# Altium schematic sheet TRACKER.SchDoc
size 699 x 500 mm; SheetNumber: 1; SheetTotal: 1
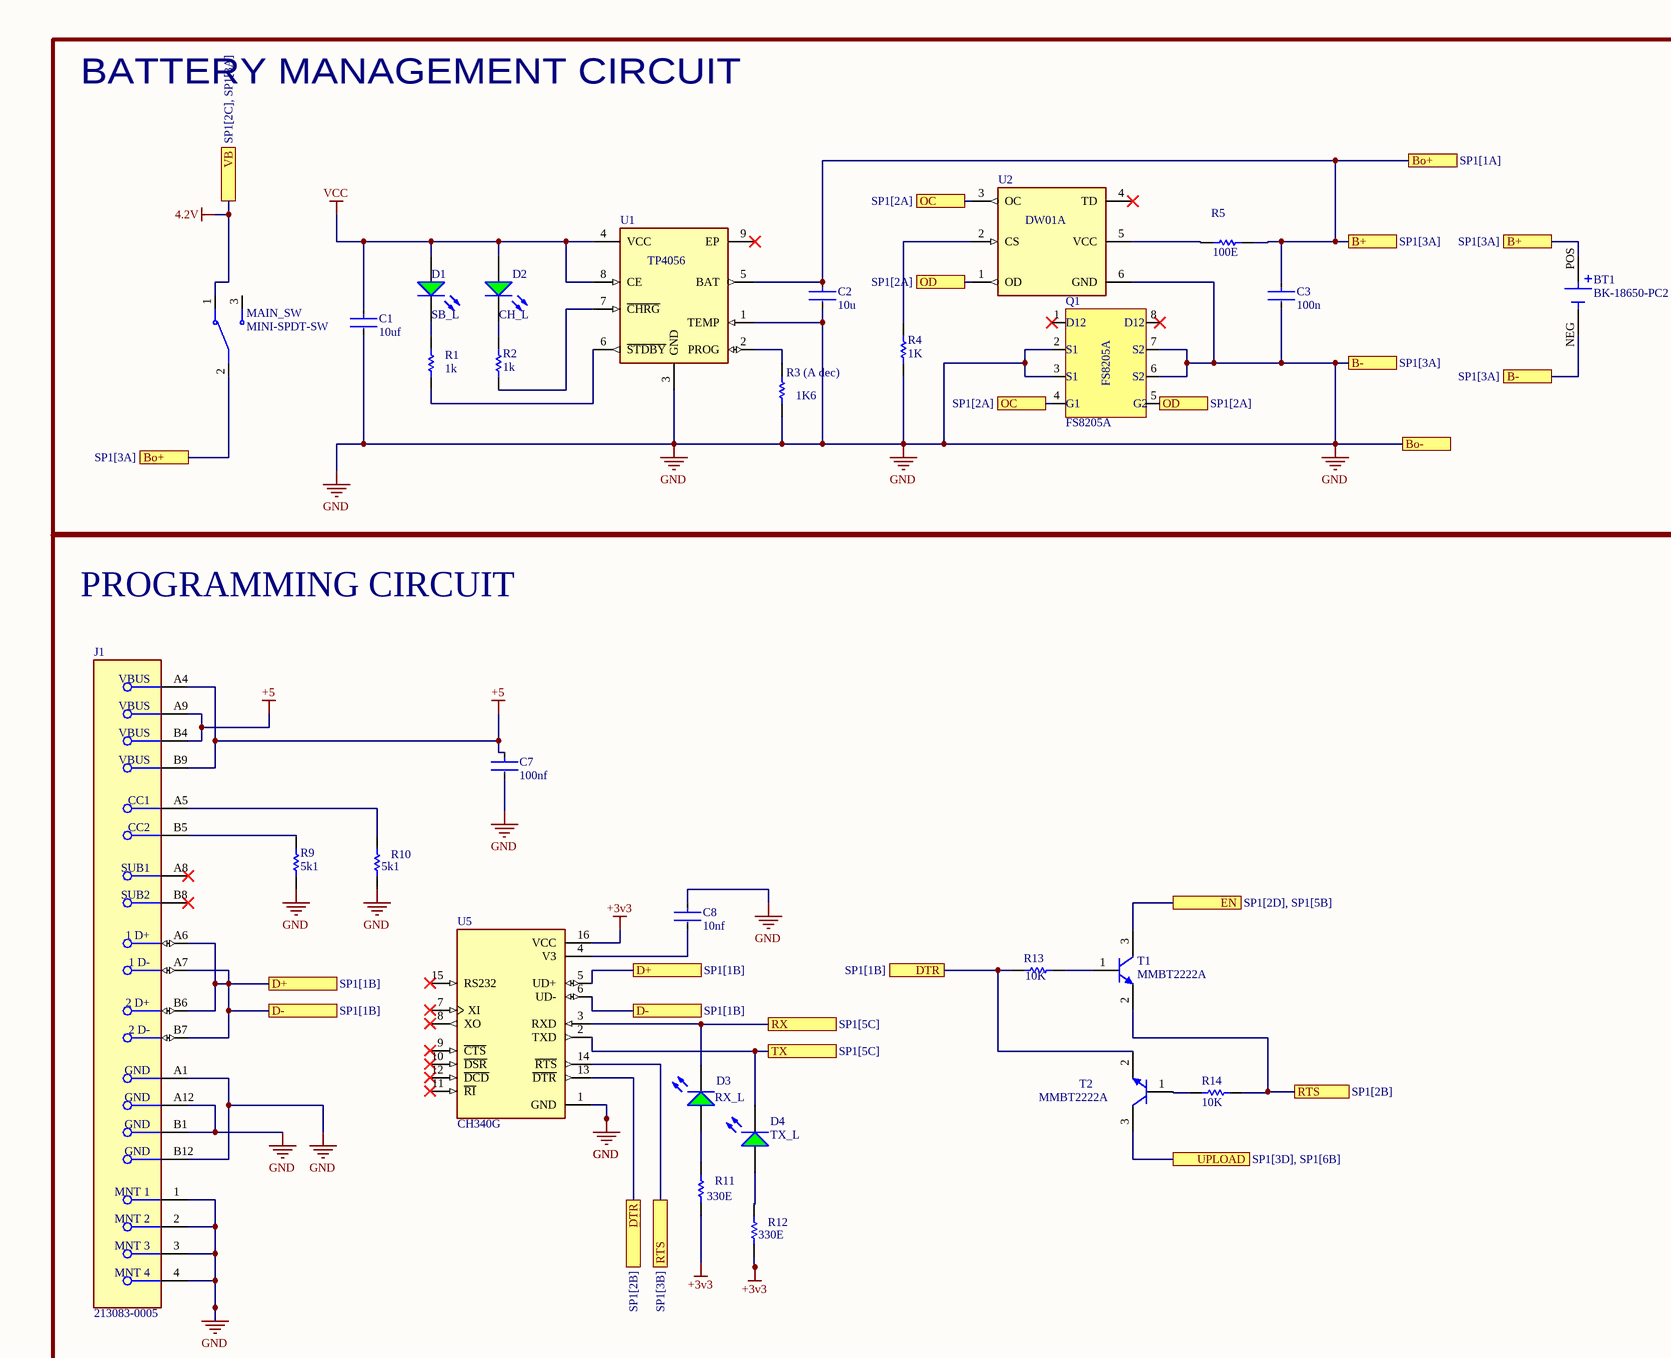
[diagram p0: TRACKER.SchDoc, top left]
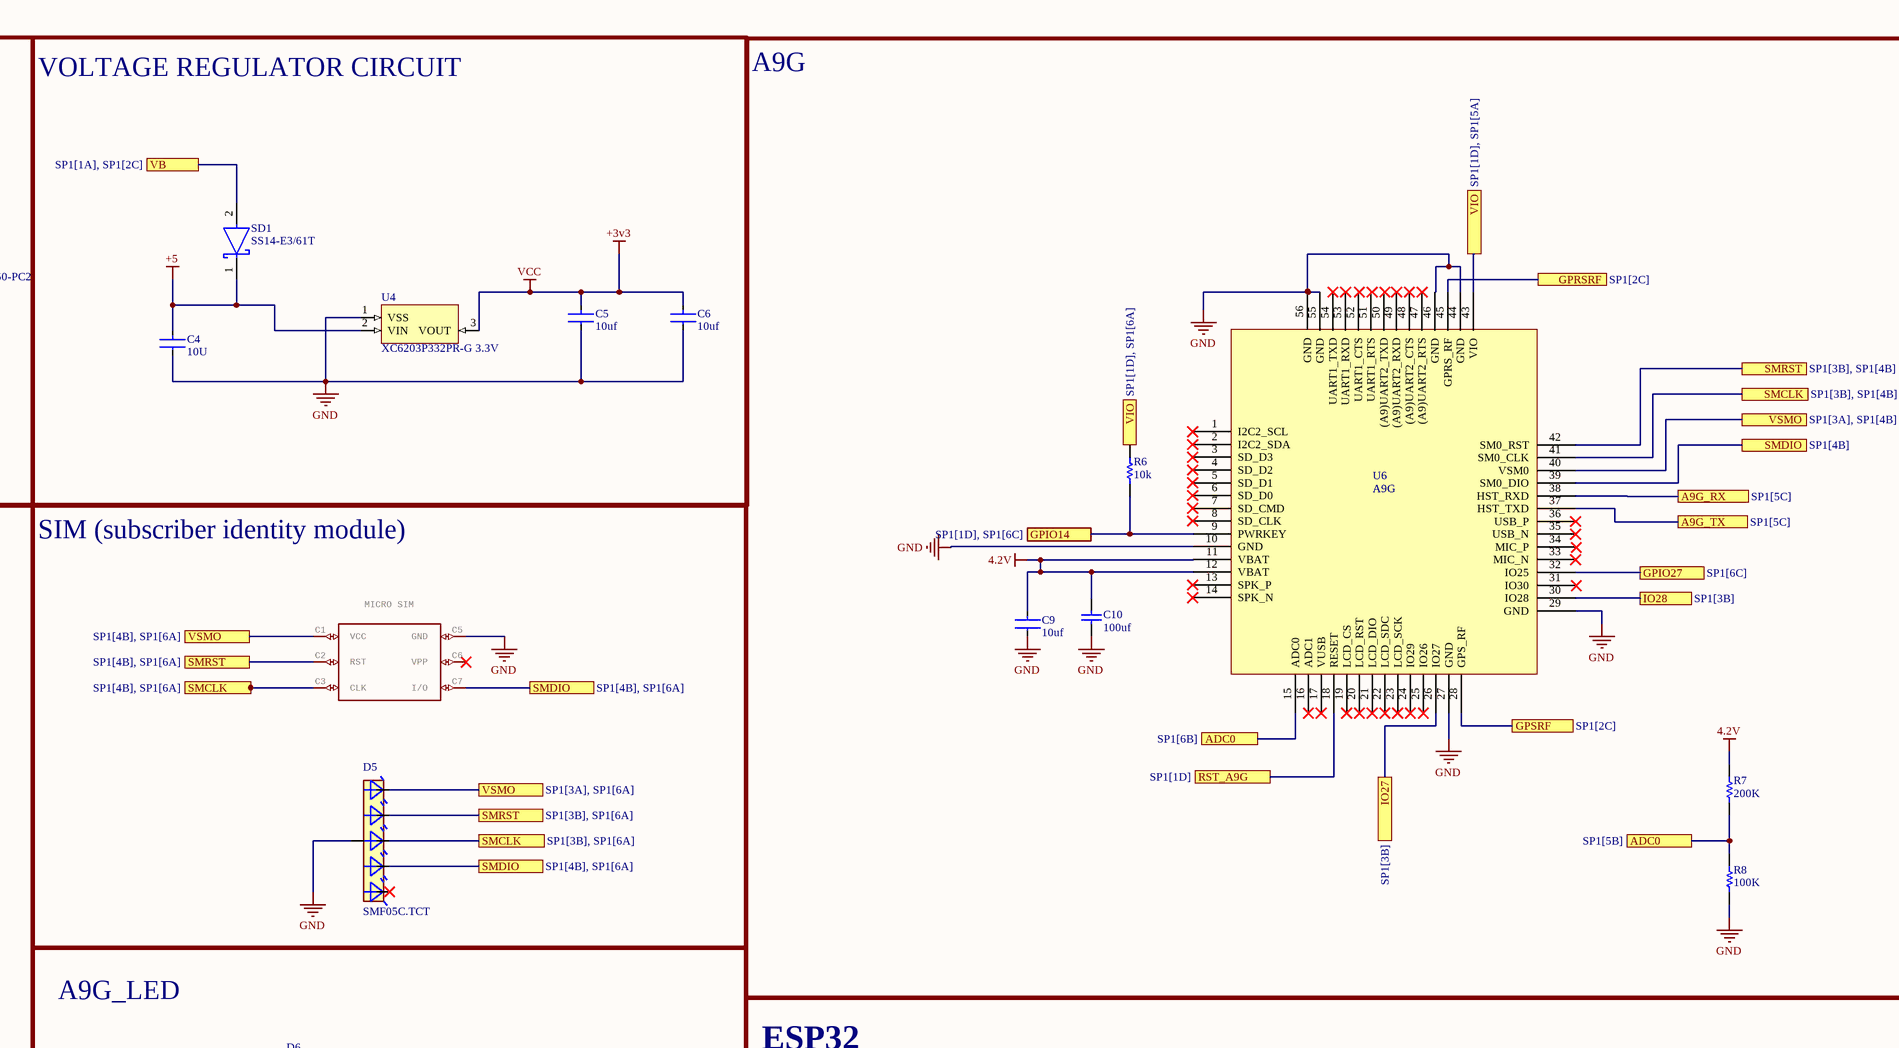
[diagram p1: TRACKER.SchDoc, top right]
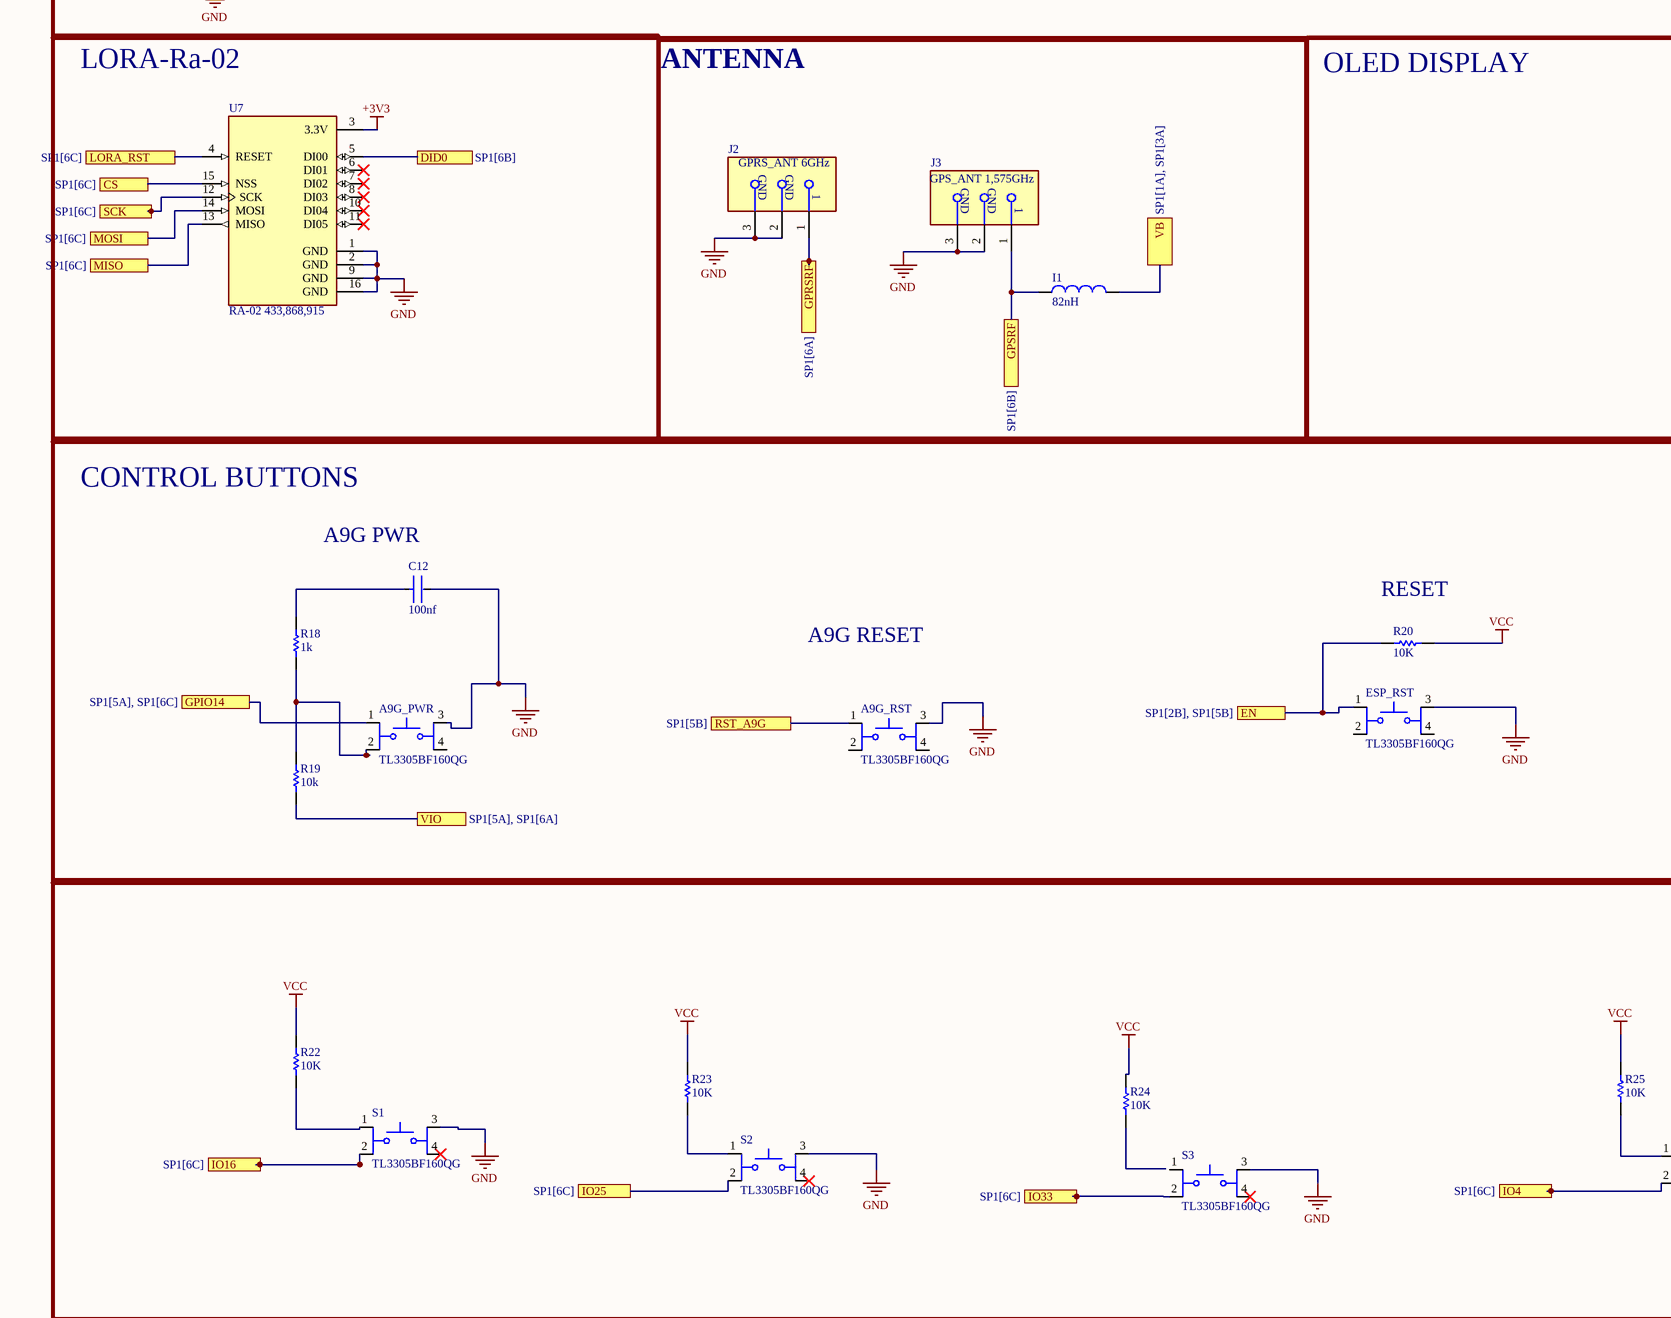
[diagram p2: TRACKER.SchDoc, bottom left]
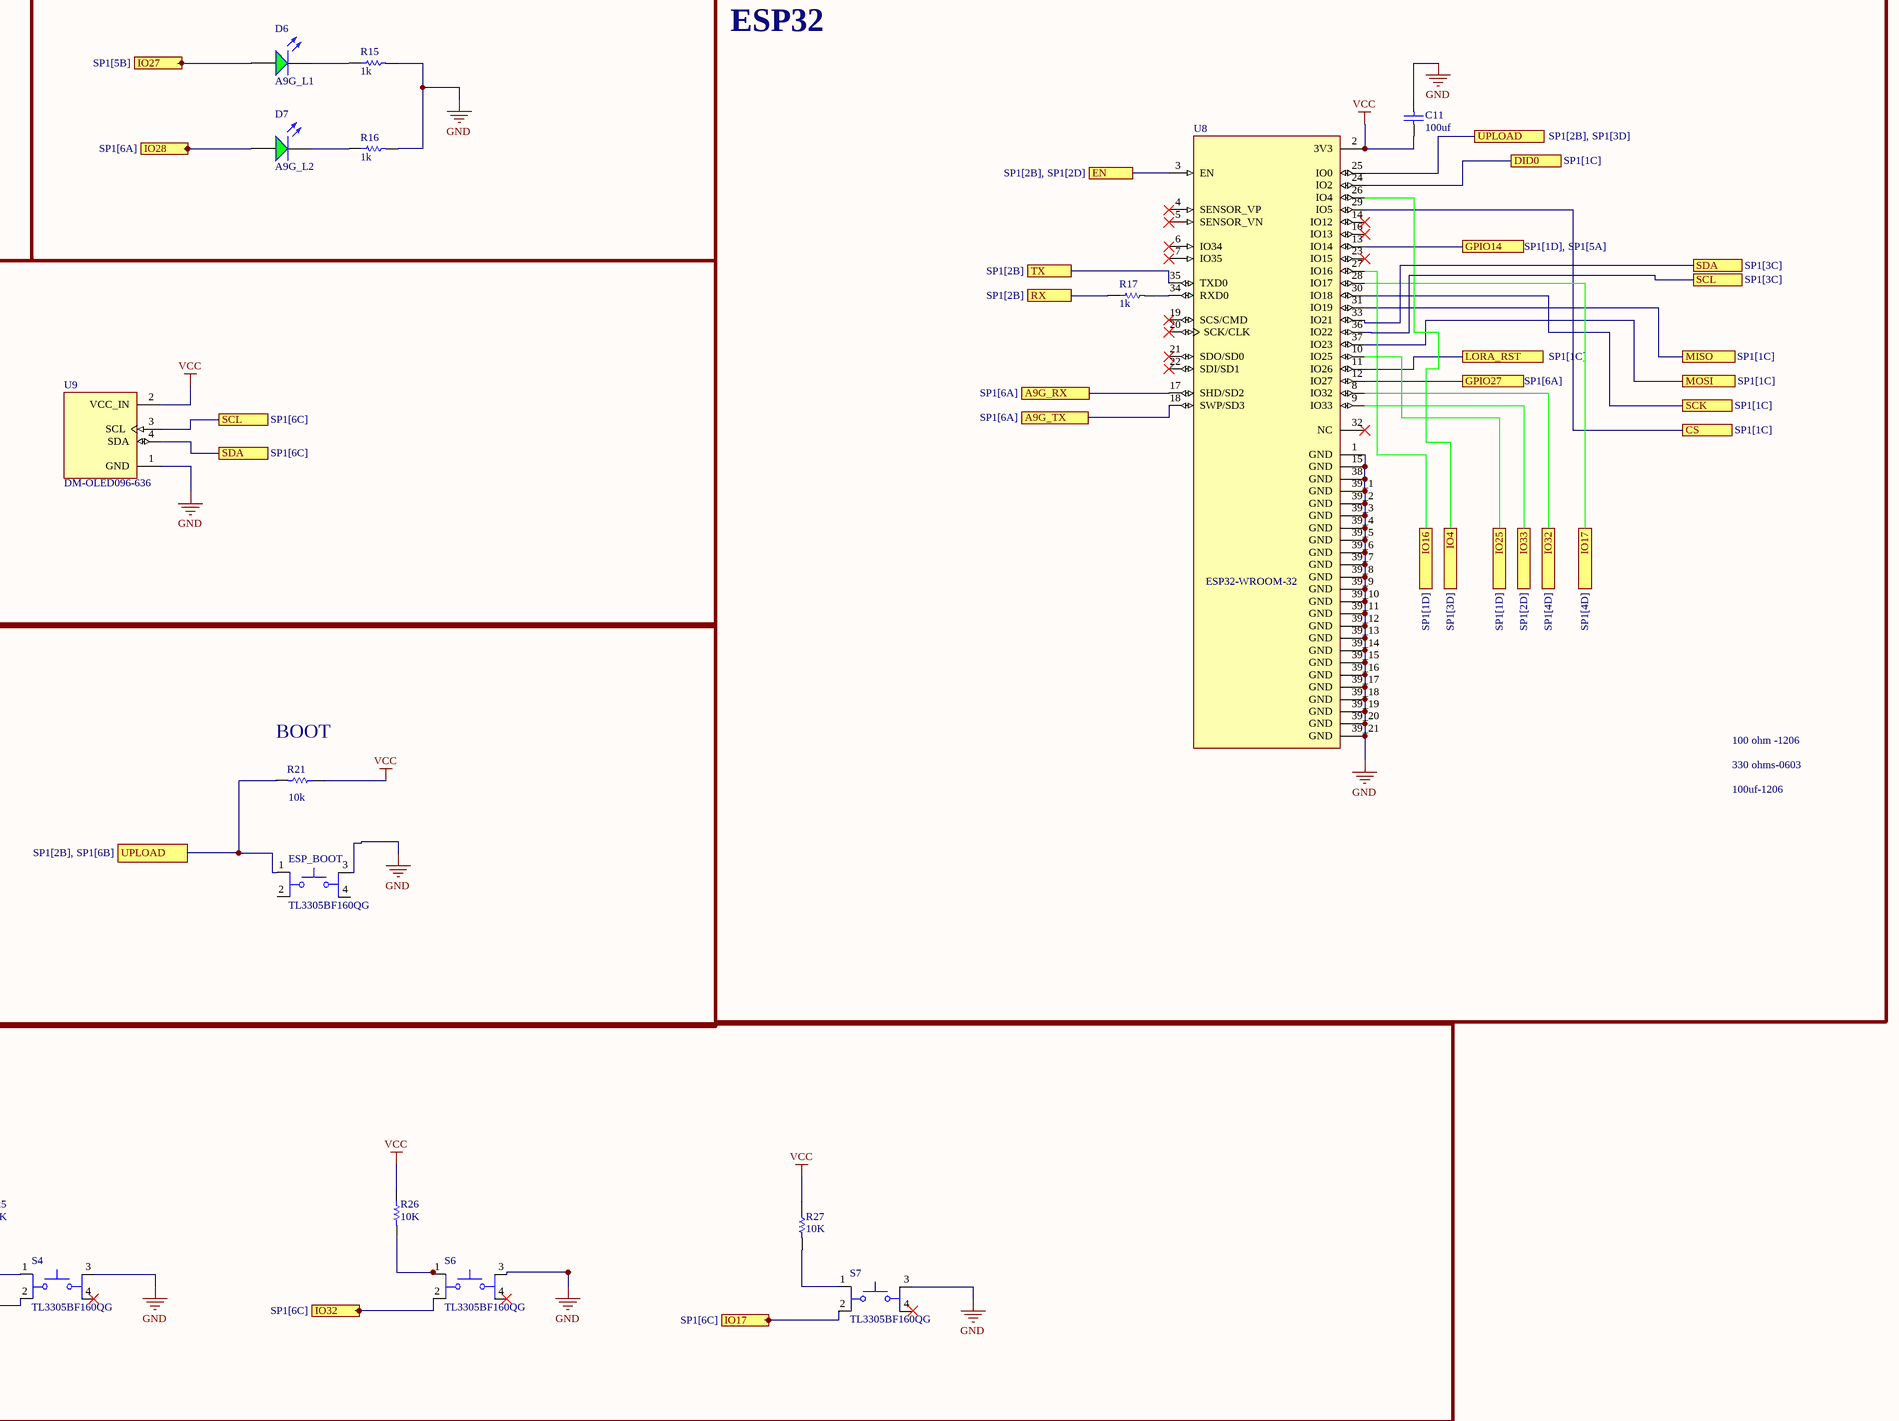
[diagram p3: TRACKER.SchDoc, bottom right]

## Parts
A9G_PWR  TL3305BF160QG  [SW_TL3305BF160QG]
A9G_RST  TL3305BF160QG  [SW_TL3305BF160QG]
BT1  BK-18650-PC2  [BAT_BK-18650-PC2]
C1  10uf  [FP-0805-L_2_01_0_2-W_1_25-MFG]
C2  10u  [FP-0805-L_2_01_0_2-W_1_25-MFG]
C3  100n  [FP-0805-L_2_01_0_2-W_1_25-MFG]
C4  10U  [FP-0805-L_2_01_0_2-W_1_25-MFG]
C5  10uf  [FP-0805-L_2_01_0_2-W_1_25-MFG]
C6  10uf  [FP-0805-L_2_01_0_2-W_1_25-MFG]
C7  100nf  [FP-0805-L_2_01_0_2-W_1_25-MFG]
C8  10nf  [FP-0805-L_2_01_0_2-W_1_25-MFG]
C9  10uf  [FP-0805-L_2_01_0_2-W_1_25-MFG]
C10  100uf  [AVX-1206-2_L]
C11  100uf  [AVX-1206-2_L]
C12  100nf  [FP-0805-L_2_01_0_2-W_1_25-MFG]
D1  SB_L  [WL-SMCW_0805_150080xx75000]
D2  CH_L  [WL-SMCW_0805_150080xx75000]
D3  RX_L  [WL-SMCW_0805_150080xx75000]
D4  TX_L  [WL-SMCW_0805_150080xx75000]
D5  SMF05C.TCT  [SC70-6]
D6  A9G_L1  [WL-SMCW_0805_150080xx75000]
D7  A9G_L2  [WL-SMCW_0805_150080xx75000]
ESP_BOOT  TL3305BF160QG  [SW_TL3305BF160QG]
ESP_RST  TL3305BF160QG  [SW_TL3305BF160QG]
I1  82nH  [INDC1608X90X30LL10T20]
J1  213083-0005  [FP-2130830005-MFG]
J2  GPRS_ANT 6GHz  [FP-U_FL-R-SMT-1_80-MFG]
J3  GPS_ANT 1,575GHz  [FP-U_FL-R-SMT-1_80-MFG]
MAIN_SW  MINI-SPDT-SW  [SW_MINI-SPDT-SW]
MICRO_SIM  6 Pin Micro SIM Holder - This is Micro SIM Card Holder â€“ SMD Type with standard interface of 6 pins. The interface for sim card is a spring loaded push type. In this interface, pushing the sim card removes or inserts it.    Buy Link  [MICRO-SIM_SIM_MICRO]  (value not drawn)
Q1  FS8205A  [SOP65P640X120-8N]
R1  1k  [RESC2013X50X30LL20T20]
R2  1k  [RESC2013X50X30LL20T20]
R3_(A_dec)  1K6  [RESC2013X50X30LL20T20]
R4  1K  [RESC2013X50X30LL20T20]
R5  100E  [RESC2013X50X30LL20T20]
R6  10k  [RESC2013X50X30LL20T20]
R7  200K  [RESC2013X50X30LL20T20]
R8  100K  [RESC2013X50X30LL20T20]
R9  5k1  [RESC2013X50X30LL20T20]
R10  5k1  [RESC2013X50X30LL20T20]
R11  330E  [RESC2013X50X30LL20T20]
R12  330E  [RESC2013X50X30LL20T20]
R13  10K  [RESC2013X50X30LL20T20]
R14  10K  [RESC2013X50X30LL20T20]
R15  1k  [RESC2013X50X30LL20T20]
R16  1k  [RESC2013X50X30LL20T20]
R17  1k  [RESC2013X50X30LL20T20]
R18  1k  [RESC2013X50X30LL20T20]
R19  10k  [RESC2013X50X30LL20T20]
R20  10K  [RESC2013X50X30LL20T20]
R21  10k  [RESC2013X50X30LL20T20]
R22  10K  [RESC2013X50X30LL20T20]
R23  10K  [RESC2013X50X30LL20T20]
R24  10K  [RESC2013X50X30LL20T20]
R25  10K  [RESC2013X50X30LL20T20]
R26  10K  [RESC2013X50X30LL20T20]
R27  10K  [RESC2013X50X30LL20T20]
S1  TL3305BF160QG  [SW_TL3305BF160QG]
S2  TL3305BF160QG  [SW_TL3305BF160QG]
S3  TL3305BF160QG  [SW_TL3305BF160QG]
S4  TL3305BF160QG  [SW_TL3305BF160QG]
S6  TL3305BF160QG  [SW_TL3305BF160QG]
S7  TL3305BF160QG  [SW_TL3305BF160QG]
SD1  SS14-E3/61T  [FP-95400-MFG]
T1  MMBT2222A  [INF-SOT23_M]
T2  MMBT2222A  [INF-SOT23_M]
U1  TP4056  [SOP127P600X175-9N]
U2  DW01A  [SOT95P280X145-6N]
U4  XC6203P332PR-G 3.3V  [SOT89-150P410X150-3N]
U5  CH340G  [SOIC127P600X180-16N]
U6  A9G  [A9G]
U7  RA-02 433,868,915  [RA-02]
U8  ESP32-WROOM-32  [MODULE_ESP32-WROOM-32]
U9  DM-OLED096-636  [MODULE_DM-OLED096-636]

## Blocks framed on the sheet
BATTERY MANAGEMENT CIRCUIT: BT1 C1-C3 D1 D2 MAIN_SW Q1 R1 R2 R3_(A_dec) R4 R5 U1 U2
VOLTAGE REGULATOR CIRCUIT: C4-C6 SD1 U4
A9G: C9 C10 R6-R8 U6
PROGRAMMING CIRCUIT: C7 C8 D3 D4 J1 R9-R14 T1 T2 U5
SIM (subscriber identity module): D5 MICRO_SIM
A9G_LED: D6 D7 R15 R16
ESP32: C11 R17 U8
LORA-Ra-02: U7
ANTENNA: I1 J2 J3
OLED DISPLAY: U9
CONTROL BUTTONS: A9G_PWR A9G_RST C12 ESP_BOOT ESP_RST R18-R21

## Ports
A9G_RX (see SP1[5C]), A9G_RX (see SP1[6A]), A9G_TX (see SP1[5C]), A9G_TX (see SP1[6A]), ADC0 (see SP1[5B]), ADC0 (see SP1[6B]), B+ (see SP1[3A]), B- (see SP1[3A]), Bo+ (see SP1[1A]), Bo+ (see SP1[3A]), Bo-, CS (see SP1[1C]), CS (see SP1[6C]), D+ (see SP1[1B]), D- (see SP1[1B]), DID0 (see SP1[1C]), DID0 (see SP1[6B]), DTR (see SP1[1B]), DTR (see SP1[2B]), EN (see SP1[2B], SP1[2D]), EN (see SP1[2B], SP1[5B]), EN (see SP1[2D], SP1[5B]), GPIO14 (see SP1[1D], SP1[5A]), GPIO14 (see SP1[1D], SP1[6C]), GPIO14 (see SP1[5A], SP1[6C]), GPIO27 (see SP1[6A]), GPIO27 (see SP1[6C]), GPRSRF (see SP1[2C]), GPRSRF (see SP1[6A]), GPSRF (see SP1[2C]), GPSRF (see SP1[6B]), IO4 (see SP1[3D]), IO4 (see SP1[6C]), IO16 (see SP1[1D]), IO16 (see SP1[6C]), IO17 (see SP1[4D]), IO17 (see SP1[6C]), IO25 (see SP1[1D]), IO25 (see SP1[6C]), IO27 (see SP1[3B]), IO27 (see SP1[5B]), IO28 (see SP1[3B]), IO28 (see SP1[6A]), IO32 (see SP1[4D]), IO32 (see SP1[6C]), IO33 (see SP1[2D]), IO33 (see SP1[6C]), LORA_RST (see SP1[1C]), LORA_RST (see SP1[6C]), MISO (see SP1[1C]), MISO (see SP1[6C]), MOSI (see SP1[1C]), MOSI (see SP1[6C]), OC (see SP1[2A]), OD (see SP1[2A]), RST_A9G (see SP1[1D]), RST_A9G (see SP1[5B]), RTS (see SP1[2B]), RTS (see SP1[3B]), RX (see SP1[2B]), RX (see SP1[5C]), SCK (see SP1[1C]), SCK (see SP1[6C]), SCL (see SP1[3C]), SCL (see SP1[6C]), SDA (see SP1[3C]), SDA (see SP1[6C]), SMCLK (see SP1[3B], SP1[4B]), SMCLK (see SP1[3B], SP1[6A]), SMCLK (see SP1[4B], SP1[6A]), SMDIO (see SP1[4B]), SMDIO (see SP1[4B], SP1[6A]), SMRST (see SP1[3B], SP1[4B]), SMRST (see SP1[3B], SP1[6A]), SMRST (see SP1[4B], SP1[6A]), TX (see SP1[2B]), TX (see SP1[5C]), UPLOAD (see SP1[2B], SP1[3D]), UPLOAD (see SP1[2B], SP1[6B]), UPLOAD (see SP1[3D], SP1[6B]), VB (see SP1[1A], SP1[2C]), VB (see SP1[1A], SP1[3A]), VB (see SP1[2C], SP1[3A]), VIO (see SP1[1D], SP1[5A]), VIO (see SP1[1D], SP1[6A]), VIO (see SP1[5A], SP1[6A]), VSMO (see SP1[3A], SP1[4B]), VSMO (see SP1[3A], SP1[6A]), VSMO (see SP1[4B], SP1[6A])

## Nets
4.2V: C9.1 C10.1 I1.2 MAIN_SW.1 R7.2 SD1.2(A) U6.12(VBAT) ; port VB
+3v3: C1.1 C5.1 C6.1 C11.1 D1.2(A) D2.2(A) R11.1 R12.1 R20.1 R21.1 R22.1 R23.1 R24.1 R25.1 R26.1 R27.1 U1.4(VCC) U1.8(CE) U4.3(VOUT) U5.16(VCC) U7.3(3.3V) U8.2(3V3) U9.2(VCC_IN)  [also labelled VCC]
+5: C4.1 C7.1 J1.A4(VBUS) J1.A9(VBUS) J1.B4(VBUS) J1.B9(VBUS) SD1.1(C) U4.2(VIN)
GND: A9G_PWR.3 A9G_RST.3 BT1.NEG C1.2 C2.2 C3.2 C4.2 C5.2 C6.2 C7.2 C8.1 C9.2 C10.2 C11.2 C12.2 D5.2(A) ESP_BOOT.3 ESP_RST.3 J1.1(MNT_1) J1.2(MNT_2) J1.3(MNT_3) J1.4(MNT_4) J1.A1(GND) J1.A12(GND) J1.B1(GND) J1.B12(GND) J2.2(GND) J2.3(GND) J3.2(GND) J3.3(GND) MICRO_SIM.C5(GND) Q1.2(S1) Q1.3(S1) Q1.6(S2) Q1.7(S2) R3_(A_dec).1 R4.1 R8.1 R9.1 R10.1 R15.2 R16.2 S1.3 S2.3 S3.3 S4.3 S6.3 S7.3 U1.1(TEMP) U1.3(GND) U2.6(GND) U4.1(VSS) U5.1(GND) U6.10(GND) U6.27(GND) U6.44(GND) U6.55(GND) U6.56(GND) U7.1(GND) U7.2(GND) U7.9(GND) U7.16(GND) U8.1(GND) U8.15(GND) U8.38(GND) U8.39_1(GND) U8.39_2(GND) U8.39_3(GND) U8.39_4(GND) U8.39_5(GND) U8.39_6(GND) U8.39_7(GND) U8.39_8(GND) U8.39_9(GND) U8.39_10(GND) U8.39_11(GND) U8.39_12(GND) U8.39_13(GND) U8.39_14(GND) U8.39_15(GND) U8.39_16(GND) U8.39_17(GND) U8.39_18(GND) U8.39_19(GND) U8.39_20(GND) U8.39_21(GND) U9.1(GND) ; port Bo-, port B-
A9G_RX: U6.38(HST_RXD) U8.17(SHD/SD2) ; port A9G_RX
A9G_TX: U6.37(HST_TXD) U8.18(SWP/SD3) ; port A9G_TX
ADC0: R7.1 R8.2 U6.15(ADC0) ; port ADC0
B+: BT1.POS C2.1 C3.1 MAIN_SW.2 R5.1 U1.5(BAT) ; port B+, port Bo+
CS: U7.15(NSS) U8.29(IO5) ; port CS
D+: J1.A6(1_D+) J1.A7(1_D-) J1.B6(2_D+) J1.B7(2_D-) U5.5(UD+) U5.6(UD-) ; port D+, port D-
DID0: U7.5(DI00) U8.24(IO2) ; port DID0
DTR: R13.1 T2.2(E) U5.13(~{DTR}) ; port DTR
EN: ESP_RST.1 R20.2 T1.3(C) U8.3(EN) ; port EN
GPIO14: A9G_PWR.1 R6.1 U6.9(PWRKEY) U8.13(IO14) ; port GPIO14
GPIO27: U6.32(IO25) U8.12(IO27) ; port GPIO27
GPRSRF: J2.1 U6.45(GPRS_RF) ; port GPRSRF
GPSRF: I1.1 J3.1 U6.28(GPS_RF) ; port GPSRF
IO4: S4.2 U8.26(IO4) ; port IO4
IO16: S1.2 U8.27(IO16) ; port IO16
IO17: S7.2 U8.28(IO17) ; port IO17
IO25: S2.2 U8.10(IO25) ; port IO25
IO27: D6.2(A) U6.26(IO27) ; port IO27
IO28: D7.2(A) U6.30(IO28) ; port IO28
IO32: S6.2 U8.8(IO32) ; port IO32
IO33: S3.2 U8.9(IO33) ; port IO33
LORA_RST: U7.4(RESET) U8.11(IO26) ; port LORA_RST
MISO: U7.13(MISO) U8.31(IO19) ; port MISO
MOSI: U7.14(MOSI) U8.37(IO23) ; port MOSI
OC: Q1.4(G1) U2.3(OC) ; port OC
OD: Q1.5(G2) U2.1(OD) ; port OD
RST_A9G: A9G_RST.1 U6.18(RESET) ; port RST_A9G
RTS: R14.2 T1.2(E) U5.14(~{RTS}) ; port RTS
RX: D3.1(K) R17.1 U5.3(RXD) ; port RX
SCK: U7.12(SCK) U8.30(IO18) ; port SCK
SCL: U8.36(IO22) U9.3(SCL) ; port SCL
SDA: U8.33(IO21) U9.4(SDA) ; port SDA
SMCLK: D5.4(C3) MICRO_SIM.C3(CLK) U6.41(SM0_CLK) ; port SMCLK
SMDIO: D5.5(C4) MICRO_SIM.C7(I/O) U6.39(SM0_DIO) ; port SMDIO
SMRST: D5.3(C2) MICRO_SIM.C2(RST) U6.42(SM0_RST) ; port SMRST
TX: D4.1(K) U5.2(TXD) U8.35(TXD0) ; port TX
UPLOAD: ESP_BOOT.1 R21.2 T2.3(C) U8.25(IO0) ; port UPLOAD
VIO: R6.2 R19.1 U6.43(VIO) ; port VIO
VSMO: D5.1(C1) MICRO_SIM.C1(VCC) U6.40(VSM0) ; port VSMO
NetA9G_PWR_2: A9G_PWR.2 R18.1 R19.2
NetC8_2: C8.2 U5.4(V3)
NetC12_1: C12.1 R18.2
NetD1_1: D1.1(K) R1.2
NetD2_1: D2.1(K) R2.2
NetD3_2: D3.2(A) R11.2
NetD4_2: D4.2(A) R12.2
NetD6_1: D6.1(K) R15.1
NetD7_1: D7.1(K) R16.1
NetJ1_A5: J1.A5(CC1) R10.2
NetJ1_B5: J1.B5(CC2) R9.2
NetR1_1: R1.1 U1.6(~{STDBY})
NetR2_1: R2.1 U1.7(~{CHRG})
NetR3_(A_dec)_2: R3_(A_dec).2 U1.2(PROG)
NetR4_2: R4.2 U2.2(CS)
NetR5_2: R5.2 U2.5(VCC)
NetR13_2: R13.2 T1.1(B)
NetR14_1: R14.1 T2.1(B)
NetR17_2: R17.2 U8.34(RXD0)
NetR22_2: R22.2 S1.1
NetR23_2: R23.2 S2.1
NetR25_2: R25.2 S4.1
NetR26_2: R26.2 S6.1
NetR27_2: R27.2 S7.1

Not connected (* = marked no-connect by the designer): A9G_PWR 4; A9G_RST 2 4; D5 6(C5)*; ESP_BOOT 2 4; ESP_RST 2 4; J1 A8(SUB1)* B8(SUB2)*; MAIN_SW 3; MICRO_SIM C6(VPP)*; Q1 1(D12)* 8(D12)*; R24 2; S1 4*; S2 4*; S3 1 4*; S4 4*; S6 4*; S7 4; U1 9(EP)*; U2 4(TD)*; U5 7(XI)* 8(XO)* 9(~{CTS})* 10(~{DSR})* 11(~{RI})* 12(~{DCD})* 15(RS232)*; U6 1(I2C2_SCL)* 2(I2C2_SDA)* 3(SD_D3)* 4(SD_D2)* 5(SD_D1)* 6(SD_D0)* 7(SD_CMD)* 8(SD_CLK)* 11(VBAT) 13(SPK_P)* 14(SPK_N)* 16(ADC1)* 17(VUSB)* 19(LCD_CS)* 20(LCD_RST)* 21(LCD_DIO)* 22(LCD_SDC)* 23(LCD_SCK)* 24(IO29)* 25(IO26)* 29(GND) 31(IO30) 33(MIC_N)* 34(MIC_P) 35(USB_N)* 36(USB_P)* 46(GND) 47((A9)UART2_RTS)* 48((A9)UART2_CTS)* 49((A9)UART2_RXD)* 50((A9)UART2_TXD) 51(UART1_RTS) 52(UART1_CTS) 53(UART1_RXD)* 54(UART1_TXD)*; U7 6(DI01)* 7(DI02)* 8(DI03)* 10(DI04)* 11(DI05)*; U8 4(SENSOR_VP)* 5(SENSOR_VN)* 6(IO34)* 7(IO35)* 14(IO12)* 16(IO13)* 19(SCS/CMD)* 20(SCK/CLK)* 21(SDO/SD0)* 22(SDI/SD1)* 23(IO15)* 32(NC)*

## Notes on the sheet
- (near C12) A9G PWR
- (near R20) RESET
- (near R21) BOOT
- 100 ohm -1206
- 330 ohms-0603
- 100uf-1206
- A9G RESET

## Library data of the parts
A9G_PWR A9G_RST ESP_BOOT ESP_RST S1-S4 S6 S7 = TL3305BF160QG: Tactile Switch SPST-NO Top Actuated Surface Mount; MF: E-Switch; SnapEDA_Link: https://www.snapeda.com/parts/TL3305BF160QG/E-Switch/view-part/?ref=snap; Package: None; MP: TL3305BF160QG; Check_prices: https://www.snapeda.com/parts/TL3305BF160QG/E-Switch/view-part/?ref=eda; Purchase-URL: https://pricing.snapeda.com/search/part/TL3305BF160QG/?ref=eda; Price: None; Value: *; Availability: In Stock
BT1 = BK-18650-PC2: Battery Holder (Open) 18650 1 Cell PC Pin; Price: None; Value: *; Package: None; Availability: Unavailable; MP: BK-18650-PC2
C1-C9 C12 = CMP-2000-05808-2: General Purpose Ceramic Capacitor, 0805, 100nF, 5%, X7R, 0.15, 50V; Dissipation Factor: 2.5%; Insulation Resistance: 100GR; Length: 2.01mm; Min Operating Temperature: -55°C; Number of Pins: 2; Width: 0.049inch; Height: 0.94mm; Max Operating Temperature: 125°C; RoHS Compliant: Yes; Depth: 1.25mm; Radiation Hardening: No; Case Code (Metric): 2012; Case/Package: 0805; Contact Plating: Tin; Mount: Surface Mount; Tolerance: 5%; Dielectric Material: Ceramic; Case Code (Imperial): 0805; Capacitance: 100nF; Dielectric: X7R; Voltage Rating: 50V; REACH SVHC: No SVHC; Thickness: 0.037inch; Voltage Rating (DC): 50V; Lead Free: Lead Free; Package Quantity: 1; Packaging: Tape and Reel; Voltage: 50V; Termination: SMD/SMT
C10 C11 = CMP-2000-05468-1: Chip Capacitor, 1 nF, +/- 10%, -55 to 125 degC, 1206 (3216 Metric), RoHS, Tape and Reel; PartNumber: 1206GC102KAT1A; Manufacturer: AVX; Capacitance: 0.001uF; Dielectric: X7R; Voltage Rating DC: 2000V; Package Reference: 1206; Datasheet Version: 11/2010; Mounting Technology: SurfaceMount; Manufacturer URL: http://www.avx.com/; Tolerance: 10%; Tolerance (%): ±10%; Datasheet URL: https://datasheet.ciiva.com/11787/0900766b80ed4c37-11787781.pdf; Package Description: 2-Pin SMD, Body 3.4 x 1.8 mm; Case Size/Dimension: 1206; Rated Voltage: 2000V
D1-D4 D6 = CMP-1426-00009-5: NexarPartId: 29717783; Color: Green; Dominant Wavelength: 570nm; Lens Style: Clear, Rectangular; Test Current: 20mA; Max Junction Temperature (Tj): 95°C; Max Reverse Voltage (DC): 5V; Forward Voltage: 2V; Forward Current: 100mA; Viewing Angle: 140°; Power Dissipation: 72mW; Peak Wavelength: 572nm; Luminous Intensity: 40mcd; Max Operating Temperature: 85°C; Case/Package: 0805; Case Code (Metric): 2012; RoHS: Compliant; Packaging: Tape and Reel; Min Operating Temperature: -40°C; Width: 1.25mm; Wavelength: 570nm; Mount: Surface Mount; Length: 2mm; REACH SVHC: Unknown; Height: 700µm; Case Code (Imperial): 0805; Reverse Voltage: 5V
D5 = SMF05C.TCT: 12.5V Clamp 8A (8/20Âµs) Ipp Tvs Diode Surface Mount SC-70-6; MF: Semtech; Check_prices: https://www.snapeda.com/parts/SMF05C.TCT/Semtech+Corporation/view-part/?ref=eda; Value: *; Availability: In Stock; MP: SMF05C.TCT; Price: None; Package: SC-70-6 Semtech; SnapEDA_Link: https://www.snapeda.com/parts/SMF05C.TCT/Semtech+Corporation/view-part/?ref=snap; Purchase-URL: https://pricing.snapeda.com/search/part/SMF05C.TCT/?ref=eda
D7 = CMP-1426-00009-5: NexarPartId: 29717783; Color: RED; Dominant Wavelength: 570nm; Lens Style: Clear, Rectangular; Test Current: 20mA; Max Junction Temperature (Tj): 95°C; Max Reverse Voltage (DC): 5V; Forward Voltage: 2V; Forward Current: 100mA; Viewing Angle: 140°; Power Dissipation: 72mW; Peak Wavelength: 572nm; Luminous Intensity: 40mcd; Max Operating Temperature: 85°C; Case/Package: 0805; Case Code (Metric): 2012; RoHS: Compliant; Packaging: Tape and Reel; Min Operating Temperature: -40°C; Width: 1.25mm; Wavelength: 570nm; Mount: Surface Mount; Length: 2mm; REACH SVHC: Unknown; Height: 700µm; Case Code (Imperial): 0805; Reverse Voltage: 5V
I1 = CMP-2000-05913-1: Unshielded Wirewound Inductor, 33 nH, 350 mA, -55 to 150 degC, 0603 (1608 Metric), RoHS, Tape and Reel; Manufacturer: EPCOS-(TDK); Q @ Freq: 14@100MHz; Inductance: 33nH; Material - Core: Ceramic; Frequency - Self Resonant: 3GHz; DC Resistance (DCR): 600mOhmMax; Tolerance: ±5%; Frequency - Test: 100MHz; Current Rating: 350mA; Manufacturer URL: http://www.tdk.com/; Type: Wirewound; Mounting Type: SurfaceMount; Mounting Technology: SurfaceMount; Height - Seated (Max): 0.035"(0.90mm); Datasheet URL: https://en.tdk.eu/inf/30/db/ind_2008/b82496c.pdf; Shielding: Unshielded; Operating Temperature: -; Size / Dimension: 0.063"Lx0.031"W(1.60mmx0.80mm); Series: SIMID; Current - Saturation: -; Ratings: AEC-Q200; Packaging: CutTape(CT); Package Reference: 0603; Datasheet Version: 07/2016; Category: Inductors,Coils,Chokes; Package Description: 2-Pin Surface Mount Device, Body 1.6 x 0.8 mm; Family: FixedInductors; Package / Case: 0603(1608Metric)
J1 = CMP-04767-000030-2: CONN RCP USB2.0 TYP C 24P SMD RA; NexarPartId: 114105384; Current Rating: 5A; Number of Contacts: 16; Voltage Rating: 30V; Gender: Receptacle; Min Operating Temperature: -40°C; USB Standard: USB 2.0; Max Operating Temperature: 85°C; Contact Material: Gold, Nickel; Schedule B: 8536695050, 8536695050; Country of Origin: CN
J2 = CMP-11598-000004-1: CONN U.FL RCPT STR 50 OHM SMD; Mating Cycles: 30; Impedance: 50R; Body Plating: Silver; Center Contact Plating: Gold; Body Material: Bronze; Dielectric Material: Polymer; Connector Type: Receptacle; Number of Ports: 1; Mount: Surface Mount; Termination: Solder; Case/Package: SMD/SMT; Min Operating Temperature: -40°C; Series: U.FL; Max Operating Temperature: 90°C; Fastening Type: SNAP-ON; RoHS Compliant: Yes; Packaging: Tape and Reel; Package Quantity: 10000; Contact Material: Brass; Housing Color: Beige; Lead Free: Lead Free; Max Frequency: 6GHz
J3 = CMP-11598-000004-1: CONN U.FL RCPT STR 50 OHM SMD; Mating Cycles: 30; Impedance: 50R; Body Plating: Silver; Center Contact Plating: Gold; Body Material: Bronze; Dielectric Material: Polymer; Connector Type: Receptacle; Number of Ports: 1; Max Frequency: 6GHz; Mount: Surface Mount; Termination: Solder; Case/Package: SMD/SMT; Min Operating Temperature: -40°C; Series: U.FL; Max Operating Temperature: 90°C; Fastening Type: SNAP-ON; RoHS Compliant: Yes; Packaging: Tape and Reel; Package Quantity: 10000; Contact Material: Brass; Housing Color: Beige; Lead Free: Lead Free
MAIN_SW = MINI-SPDT-SW: Simple breadboard friendly SPDT slide switch. Rated at 30V/200mA with operating force of 250 +/-100gf.; Availability: Unavailable; Package: None; MP: MINI-SPDT-SW; Value: *; Price: None
MICRO_SIM = MICRO-SIM_MICRO_SIM: GateName_1: G$1; SymbolName_1: MICRO-SIM_MICRO_SIM; LibraryName: Micro Sim; DeviceSetName: MICRO-SIM_MICRO_SIM; Package: MICRO-SIM_SIM_MICRO
Q1 = FS8205A: N/A; MF: Fortune Semiconductor; MP: FS8205A; Value: *; Availability: Not in stock; Package: Package; Price: None; SnapEDA_Link: https://www.snapeda.com/parts/FS8205A/Fortune+Semiconductor/view-part/?ref=snap; Check_prices: https://www.snapeda.com/parts/FS8205A/Fortune+Semiconductor/view-part/?ref=eda
R1 R2 R3_(A_dec) R4-R27 = CMP-2001-04896-1: Manufacturer: Vishay Dale; Part Number: CRCW08050000Z0EA
SD1 = CMP-02539-000035-1: DIODE SCHOTTKY 40V 1A DO214AC; Manufacturer: Vishay; Peak Reverse Current: 0.2mA; Standoff Height: 0mm; Max Junction Temp: +150°C; Max Surge Forward Current: 40A; RoHS: TRUE; Digikey Description: DIODE SCHOTTKY 40V 1A DO214AC; Category: Diode; Device Class L3: Schottky Diodes; Temperature Range High: +150°C; Automotive: No; Temperature: -65°C to +150°C; Device Class L2: Diodes; Forward Current: 1A; Temperature Range Low: -65°C; Footprint Url: http://www.vishay.com/docs/95400/sma.pdf; Octopart: https://octopart.com/ss14-e3%2F61t-vishay-39552847; Package: 95400; Max Repetitive Reverse Voltage: 40V; ComponentLink2Description: Datasheet; ComponentLink2URL: http://www.vishay.com/docs/88746/ss12.pdf; Lead Free: Yes; Height: 2.29mm; Mouser Description: SS14 Series 40 V 1 A Surface Mount Schottky Barrier Rectifier - DO-214AC (SMA); Manufacturer Part Number: SS14-E3/61T; Device Class L1: Discrete Semiconductors
T1 T2 = CMP-1178-00009-1: NPN Silicon Switching Transistor, 40 V VCEO, 600 mA IC, SOT23, Reel, Green; Manufacturer: Infineon; VCBO (max): 75 V; IC: 150 mA; ICBO (max): 10 nA; VCE (max): 10 V; VCEO (max): 40 V; VEBO (max): 6 V; IC (max): 600 mA; Green: TRUE; ComponentLink1URL: http://www.infineon.com/; ComponentLink2Description: Datasheet; Mounting Technology: Surface Mount; ComponentLink3URL: http://www.infineon.com/dgdl/SOT23-Package_Overview.pdf?folderId=db3a30431936bc4b0119532290053c66&fileId=db3a30431936bc4b0119533468123c85; PackageDescription: 3-Pin Small Outline Transistor Package, 1.3 x 2.9 mm Body, 0.95 mm Pitch; Packing: Reel; PackageVersion: Apr-08; PartNumber: MMBT2222A; Polarity: NPN; ComponentLink2URL: http://www.infineon.com/dgdl/smbt2222a_mmbt2222a.pdf?folderId=db3a30431441fb5d011445fab851018e&fileId=db3a30431441fb5d011445fbaff0018f; PackageReference: SOT23; VCE: 10 V; ComponentLink1Description: Manufacturer URL; ComponentLink3Description: Package Specification
U1 = TP4056: Complete single cell Li-Ion battery with a constant current / constant voltage linear charger; MF: NanJing Top Power ASIC Corp.; Check_prices: https://www.snapeda.com/parts/TP4056/NanJing+Top+Power+ASIC+Corp./view-part/?ref=eda; SnapEDA_Link: https://www.snapeda.com/parts/TP4056/NanJing+Top+Power+ASIC+Corp./view-part/?ref=snap; Price: None; Availability: Not in stock; Package: Package; MP: TP4056; Value: *
U2 = DW01A: One Cell Lithium-ion/Polymer Battery Protection IC; MF: Fortune Semiconductor; SnapEDA_Link: https://www.snapeda.com/parts/DW01A/Fortune+Semiconductor/view-part/?ref=snap; Package: SOT-23-6 Fortune Semiconductor; Value: *; MP: DW01A; Check_prices: https://www.snapeda.com/parts/DW01A/Fortune+Semiconductor/view-part/?ref=eda
U5 = CH340G: USB Interface Integrated Circuit; MF: WCH; Value: *; SnapEDA_Link: https://www.snapeda.com/parts/Ch340G/WCH/view-part/?ref=snap; MP: Ch340G; Check_prices: https://www.snapeda.com/parts/Ch340G/WCH/view-part/?ref=eda; Availability: Not in stock; Price: None; Package: None
U7 = RA-02: General ISM < 1GHz LoRaâ„¢ Transceiver Module 410MHz ~ 525MHz Antenna Not Included, I-PEX Surface Mount; MF: Ai-Thinker; Package: None; Price: None; Value: *; SnapEDA_Link: https://www.snapeda.com/parts/RA-02/AI-Thinker/view-part/?ref=snap; MP: RA-02; Availability: Not in stock; Check_prices: https://www.snapeda.com/parts/RA-02/AI-Thinker/view-part/?ref=eda
U8 = ESP32-WROOM-32: Bluetooth, WiFi 802.11b/g/n, Bluetooth v4.2 +EDR, Class 1, 2 and 3 Transceiver Module 2.4GHz ~ 2.5GHz Antenna Not Included, U.FL Surface Mount; MF: Espressif Systems; Price: None; Availability: In Stock; MP: ESP32-WROOM-32; Package: Module Espressif Systems; SnapEDA_Link: https://www.snapeda.com/parts/ESP32-WROOM-32/Espressif+Systems/view-part/?ref=snap; Check_prices: https://www.snapeda.com/parts/ESP32-WROOM-32/Espressif+Systems/view-part/?ref=eda; Value: *; Purchase-URL: https://pricing.snapeda.com/search/part/ESP32-WROOM-32/?ref=eda
U9 = DM-OLED096-636: 0.96â€ 128 X 64 MONOCHROME GRAPHIC OLED DISPLAY MODULE - I2C; SnapEDA_Link: https://www.snapeda.com/parts/DM-OLED096-636/Display+Module/view-part/?ref=snap; Package: Package; Value: *; MF: Display Module; MP: DM-OLED096-636; Check_prices: https://www.snapeda.com/parts/DM-OLED096-636/Display+Module/view-part/?ref=eda